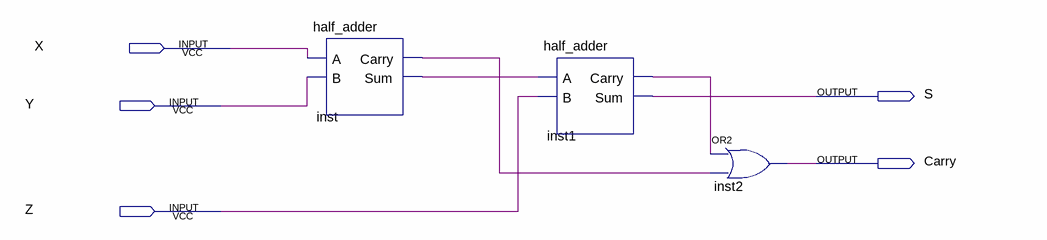
[diagram p0: schematic sheet]
// Quartus schematic full_adder.bdf as structural Verilog: 3 symbols, 5 pins
module full_adder (
  input  X,
  input  Y,
  input  Z,
  output S,
  output Carry
);

  wire inst1_carry, inst_carry, inst_sum;

  half_adder inst (.A(X), .B(Y), .Carry(inst_carry), .Sum(inst_sum));
  half_adder inst1 (.A(inst_sum), .B(Z), .Carry(inst1_carry), .Sum(S));
  or inst2 (Carry, inst1_carry, inst_carry);
endmodule
